# EAGLE design x8-oDisplayV1.3 (EAGLE 6.5.0)
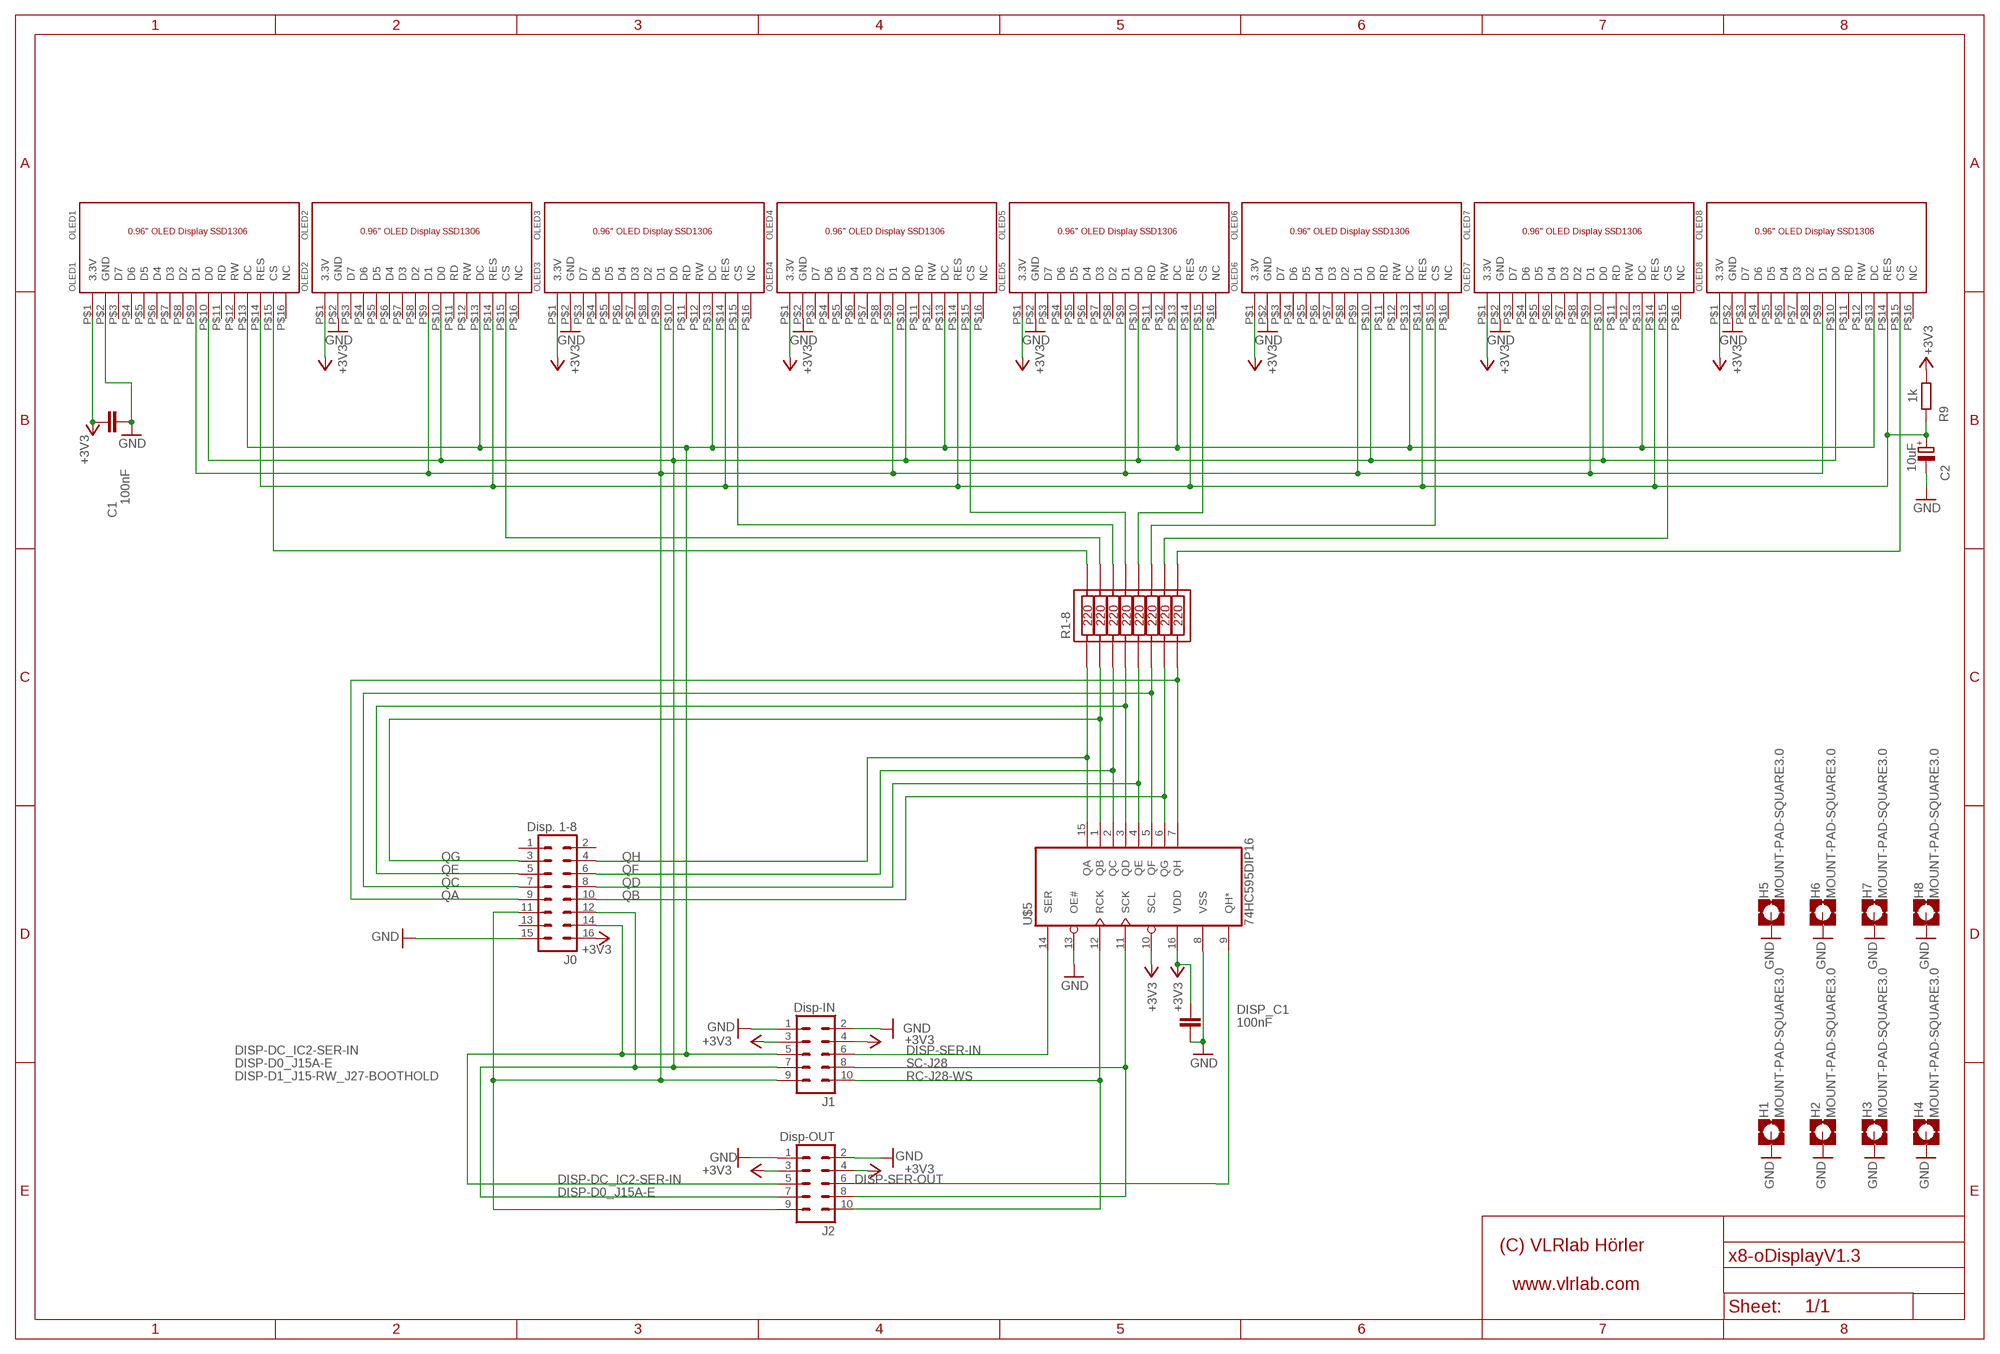
[diagram p0: schematic, sheet 1]

## Parts
C1  100nF  C5/3  [C5B3]
C2  10uF  CPOL-EUE2.5-6  [E2,5-6]
DISP_C1  100nF  C5/3  [C5B3]
H1  MOUNT-PAD-SQUARE3.0  [3,0-PAD-SQUARE]
H2  MOUNT-PAD-SQUARE3.0  [3,0-PAD-SQUARE]
H3  MOUNT-PAD-SQUARE3.0  [3,0-PAD-SQUARE]
H4  MOUNT-PAD-SQUARE3.0  [3,0-PAD-SQUARE]
H5  MOUNT-PAD-SQUARE3.0  [3,0-PAD-SQUARE]
H6  MOUNT-PAD-SQUARE3.0  [3,0-PAD-SQUARE]
H7  MOUNT-PAD-SQUARE3.0  [3,0-PAD-SQUARE]
H8  MOUNT-PAD-SQUARE3.0  [3,0-PAD-SQUARE]
J0  Disp. 1-8  ML16  [ML16]
J1  Disp-IN  ML10  [ML10]
J2  Disp-OUT  ML10  [ML10]
OLED1  OLED1  0.96"OLED  [0.96"]
OLED2  OLED2  0.96"OLED  [0.96"]
OLED3  OLED3  0.96"OLED  [0.96"]
OLED4  OLED4  0.96"OLED  [0.96"]
OLED5  OLED5  0.96"OLED  [0.96"]
OLED6  OLED6  0.96"OLED  [0.96"]
OLED7  OLED7  0.96"OLED  [0.96"]
OLED8  OLED8  0.96"OLED  [0.96"]
R1-8  4116R  [DIL16]
R9  1k  R-EU_0204/7  [0204/7]
U$5  74HC595DIP16  [DIL16]

## Nets
+3V3 [VDD]: C1.1 DISP_C1.1 J0.16 J1.3 J1.4 J2.3 J2.4 OLED1.P$1(3.3V) OLED2.P$1(3.3V) OLED3.P$1(3.3V) OLED4.P$1(3.3V) OLED5.P$1(3.3V) OLED6.P$1(3.3V) OLED7.P$1(3.3V) OLED8.P$1(3.3V) R9.2 U$5.10(SCL) U$5.16(VDD)
DISP-D0_J15A-E: J0.12 J1.7 J2.7 OLED1.P$10(D0) OLED2.P$10(D0) OLED3.P$10(D0) OLED4.P$10(D0) OLED5.P$10(D0) OLED6.P$10(D0) OLED7.P$10(D0) OLED8.P$10(D0)
DISP-D1_J15-RW_J27-BOOTHOLD: J0.11 J1.9 J2.9 OLED1.P$9(D1) OLED2.P$9(D1) OLED3.P$9(D1) OLED4.P$9(D1) OLED5.P$9(D1) OLED6.P$9(D1) OLED7.P$9(D1) OLED8.P$9(D1)
DISP-DC_IC2-SER-IN: J0.14 J1.5 J2.5 OLED1.P$13(DC) OLED2.P$13(DC) OLED3.P$13(DC) OLED4.P$13(DC) OLED5.P$13(DC) OLED6.P$13(DC) OLED7.P$13(DC) OLED8.P$13(DC)
DISP-SER-IN: J1.6 U$5.14(SER)
DISP-SER-OUT: J2.6 U$5.9(QH*)
GND: C1.2 C2.- DISP_C1.2 H1.B3,0(MOUNT) H2.B3,0(MOUNT) H3.B3,0(MOUNT) H4.B3,0(MOUNT) H5.B3,0(MOUNT) H6.B3,0(MOUNT) H7.B3,0(MOUNT) H8.B3,0(MOUNT) J0.15 J1.1 J1.2 J2.1 J2.2 OLED1.P$2(GND) OLED2.P$2(GND) OLED3.P$2(GND) OLED4.P$2(GND) OLED5.P$2(GND) OLED6.P$2(GND) OLED7.P$2(GND) OLED8.P$2(GND) U$5.8(VSS) U$5.13(OE#)
QA: J0.9 R1-8.16 U$5.7(QH)
QAA: OLED8.P$15(CS) R1-8.8
QB: J0.10 R1-8.15 U$5.6(QG)
QBB: OLED7.P$15(CS) R1-8.7
QC: J0.7 R1-8.14 U$5.5(QF)
QCC: OLED6.P$15(CS) R1-8.6
QD: J0.8 R1-8.13 U$5.4(QE)
QDD: OLED5.P$15(CS) R1-8.5
QE: J0.5 R1-8.12 U$5.3(QD)
QEE: OLED4.P$15(CS) R1-8.4
QF: J0.6 R1-8.11 U$5.2(QC)
QFF: OLED3.P$15(CS) R1-8.3
QG: J0.3 R1-8.10 U$5.1(QB)
QGG: OLED2.P$15(CS) R1-8.2
QH: J0.4 R1-8.9 U$5.15(QA)
QHH: OLED1.P$15(CS) R1-8.1
RC-J28-WS: J1.10 J2.10 U$5.12(RCK)
RST: C2.+ OLED1.P$14(RES) OLED2.P$14(RES) OLED3.P$14(RES) OLED4.P$14(RES) OLED5.P$14(RES) OLED6.P$14(RES) OLED7.P$14(RES) OLED8.P$14(RES) R9.1
SC-J28: J1.8 J2.8 U$5.11(SCK)
Unconnected: J0.1 J0.2 J0.13 OLED1.P$3(D7) OLED1.P$4(D6) OLED1.P$5(D5) OLED1.P$6(D4) OLED1.P$7(D3) OLED1.P$8(D2) OLED1.P$11(RD) OLED1.P$12(RW) OLED1.P$16(NC) OLED2.P$3(D7) OLED2.P$4(D6) OLED2.P$5(D5) OLED2.P$6(D4) OLED2.P$7(D3) OLED2.P$8(D2) OLED2.P$11(RD) OLED2.P$12(RW) OLED2.P$16(NC) OLED3.P$3(D7) OLED3.P$4(D6) OLED3.P$5(D5) OLED3.P$6(D4) OLED3.P$7(D3) OLED3.P$8(D2) OLED3.P$11(RD) OLED3.P$12(RW) OLED3.P$16(NC) OLED4.P$3(D7) OLED4.P$4(D6) OLED4.P$5(D5) OLED4.P$6(D4) OLED4.P$7(D3) OLED4.P$8(D2) OLED4.P$11(RD) OLED4.P$12(RW) OLED4.P$16(NC) OLED5.P$3(D7) OLED5.P$4(D6) OLED5.P$5(D5) OLED5.P$6(D4) OLED5.P$7(D3) OLED5.P$8(D2) OLED5.P$11(RD) OLED5.P$12(RW) OLED5.P$16(NC) OLED6.P$3(D7) OLED6.P$4(D6) OLED6.P$5(D5) OLED6.P$6(D4) OLED6.P$7(D3) OLED6.P$8(D2) OLED6.P$11(RD) OLED6.P$12(RW) OLED6.P$16(NC) OLED7.P$3(D7) OLED7.P$4(D6) OLED7.P$5(D5) OLED7.P$6(D4) OLED7.P$7(D3) OLED7.P$8(D2) OLED7.P$11(RD) OLED7.P$12(RW) OLED7.P$16(NC) OLED8.P$3(D7) OLED8.P$4(D6) OLED8.P$5(D5) OLED8.P$6(D4) OLED8.P$7(D3) OLED8.P$8(D2) OLED8.P$11(RD) OLED8.P$12(RW) OLED8.P$16(NC)

## Library data of the parts
C1 DISP_C1 = capacitor-wima:C: CAPACITOR naming: grid - package width
C2 = rcl:CPOL-EU: POLARIZED CAPACITOR, European symbol
H1-H8 = holes:MOUNT-PAD-SQUARE: MOUNTING PAD, square
J0 = con-ml:ML16: HARTING; OC_FARNELL: unknown; OC_NEWARK: unknown
J1 J2 = con-harting-ml:ML10: HARTING; OC_FARNELL: unknown; OC_NEWARK: unknown
OLED1-OLED8 = 0.96" 128x64 OLED:0.96"OLED
R1-8 = Bourns Resistor Array:4116R
R9 = resistor:R-EU_: RESISTOR, European symbol
U$5 = 595-541-165-uln2803:74HC595

## Net classes
0 default: width 0.254 mm, drill 0.33 mm, clearance 0.203 mm
1 VDD: width 0.813 mm, drill 0.33 mm, clearance 0.203 mm to class 0, clearance 0.203 mm

## Board
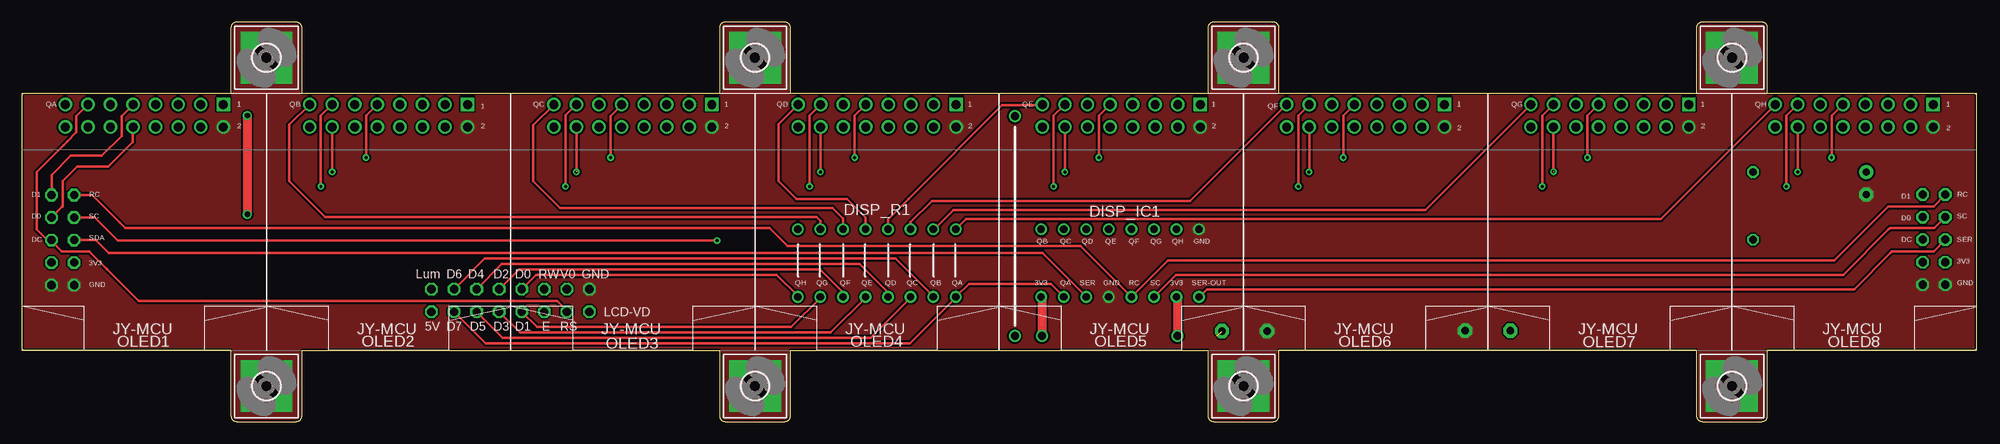
[diagram p1: board, top side]
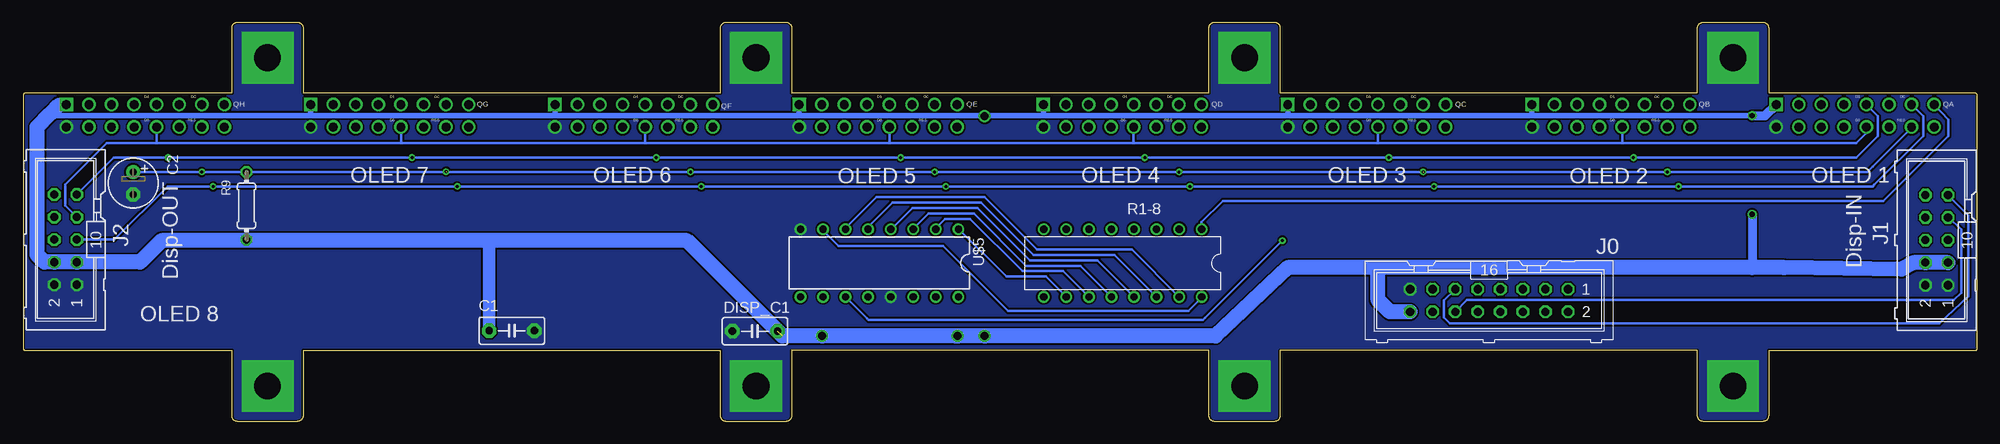
[diagram p2: board, bottom side, seen from below]

Size 220 x 45 mm. Coordinates in mm from the lower left corner, seen from the top.
Outline: 31.5,8 78.5,8 78.5,0.63 arc90 79.14,0 85.86,0 arc90 86.5,0.63 86.5,8 133.5,8 133.5,0.63 arc90 134.13,0 140.87,0 arc90 141.5,0.63 141.5,8 188.5,8 188.5,0.63 arc90 189.13,0 195.87,0 arc90 196.5,0.63 196.5,8 219.75,8 arc90 220,8.25 220,36.75 arc90 219.75,37 196.5,37 196.5,44.37 arc90 195.87,45 189.13,45 arc90 188.5,44.37 188.5,37 141.5,37 141.5,44.37 arc90 140.87,45 134.13,45 arc90 133.5,44.37 133.5,37 86.5,37 86.5,44.37 arc90 85.86,45 79.14,45 arc90 78.5,44.37 78.5,37 31.5,37 31.5,44.37 arc90 30.86,45 24.14,45 arc90 23.5,44.37 23.5,37 0.25,37 arc90 0,36.75 0,8.25 arc90 0.25,8 23.5,8 23.5,0.63 arc90 24.14,0 30.86,0 arc90 31.5,0.63 31.5,8
Copper layers (1*16): Top 0.035mm / dielectric 1.5mm / Bottom 0.035mm
Design rules "makePCB *": minimum track width 10mil, minimum drill 13mil, track to track 8mil, track to pad 8mil, pad to pad 8mil, via to via 8mil, smd to smd 8mil, copper to edge 8mil, drill to drill 8mil, minimum pad ring 10mil, minimum via ring 8mil, stop-mask expansion 4mil, vias tented up to drill 0mil, thermal gap 0mil

### Footprints (pad centres in the part's own frame; a part is rotated, then mirrored left to right if it is on the bottom)
C5B3 = drill 0.813 pad 1.6 octagon: 1 -2.54,0; 2 2.54,0
E2,5-6 = drill 0.813 pad 1.6: + -1.27,0 | drill 0.813 pad 1.6 octagon: - 1.27,0
3,0-PAD-SQUARE = drill 3 pad 5.842 square: B3,0 0,0
ML16 = drill 0.914 octagon: 1 -8.89,-1.27; 2 -8.89,1.27; 3 -6.35,-1.27; 4 -6.35,1.27; 5 -3.81,-1.27; 6 -3.81,1.27; 7 -1.27,-1.27; 8 -1.27,1.27; 9 1.27,-1.27; 10 1.27,1.27; 11 3.81,-1.27; 12 3.81,1.27; 13 6.35,-1.27; 14 6.35,1.27; 15 8.89,-1.27; 16 8.89,1.27
ML10 = drill 0.914 octagon: 1 -5.08,-1.27; 2 -5.08,1.27; 3 -2.54,-1.27; 4 -2.54,1.27; 5 0,-1.27; 6 0,1.27; 7 2.54,-1.27; 8 2.54,1.27; 9 5.08,-1.27; 10 5.08,1.27
0.96" = drill 1 square: P$1 22.64,27.73 | drill 1: P$2 22.64,25.19; P$3 20.1,27.73; P$4 20.1,25.19; P$5 17.56,27.73; P$6 17.56,25.19; P$7 15.02,27.73; P$8 15.02,25.19; P$9 12.48,27.73; P$10 12.48,25.19; P$11 9.94,27.73; P$12 9.94,25.19; P$13 7.4,27.73; P$14 7.4,25.19; P$15 4.86,27.73; P$16 4.86,25.19
DIL16 = drill 0.813: 1 -8.89,-3.81; 2 -6.35,-3.81; 3 -3.81,-3.81; 4 -1.27,-3.81; 5 1.27,-3.81; 6 3.81,-3.81; 7 6.35,-3.81; 8 8.89,-3.81; 9 8.89,3.81; 10 6.35,3.81; 11 3.81,3.81; 12 1.27,3.81; 13 -1.27,3.81; 14 -3.81,3.81; 15 -6.35,3.81; 16 -8.89,3.81
0204/7 = drill 0.813 octagon: 1 -3.81,0; 2 3.81,0

### Placement (x,y rotation side)
C1  165,10.24 0 bottom
C2  207.62,26.85 270 bottom
DISP_C1  137.62,10.18 180 bottom
H1  27.5,4 0 top
H2  82.5,4 0 top
H3  137.5,4 0 top
H4  192.5,4 0 top
H5  27.5,41 0 top
H6  82.5,41 0 top
H7  137.5,41 0 top
H8  192.5,41 0 top
J0  54.97,13.64 180 bottom
J1  4.57,20.45 90 bottom
J2  215.24,20.5 90 bottom
OLED1  0,8 0 top
OLED2  27.5,8 0 top
OLED3  55,8 0 top
OLED4  82.5,8 0 top
OLED5  110,8 0 top
OLED6  137.5,8 0 top
OLED7  165,8 0 top
OLED8  192.5,8 0 top
R1-8  96.22,17.86 180 bottom
R9  194.87,24.31 270 bottom
U$1  [X8ODISPLAY]  49.58,21.61 0 bottom
U$2  [VLRLAB]  81.08,22.02 0 bottom
U$4  [(C)T.KLOSE]  150.16,24.66 180 bottom
U$5  123.6,17.86 180 bottom

### Tracks (layer width: path | path; a pad name or v marks a point on that pad's centre or on a via)
+3V3  (via drill 0.6, 0.9)  (1 unrouted)
  Top 1.016: v25.35,34.47 v25.35,23.34 | U$5.16 114.81,14.04 v114.81,9.63 | U$5.10 130.05,13.95 v130.05,9.63
  Bottom 0.305: 167.84,20.39 179.93,20.39 R9.2 | v111.76,34.42 111.4,34.42 111.35,34.47
  Bottom 0.61: v25.35,34.47 50.19,34.47 | 50.19,34.47 77.78,34.47 | 77.78,34.47 105.26,34.47 | 105.26,34.47 111.35,34.47 132.64,34.47 | 132.64,34.47 160.17,34.47 | 160.17,34.47 187.71,34.47 | 187.71,34.47 216.36,34.47 216.46,34.47 216.81,34.82 | OLED7.P$1 187.64,34.53 187.71,34.47 | OLED6.P$1 160.14,34.5 160.17,34.47 | OLED5.P$1 132.64,34.47 | OLED4.P$1 105.14,34.58 105.26,34.47 | OLED3.P$1 77.64,34.6 77.78,34.47 | OLED2.P$1 50.14,34.52 50.19,34.47 | 215.24,35.64 215.19,35.64 216,35.64 | 25.35,16.99 21.74,17.35
  Bottom 0.813: 215.19,35.64 OLED8.P$1
  Bottom 1.016: v25.35,23.34 25.35,16.99 | v25.35,34.47 23.9,34.47 OLED1.P$1
  Bottom 1.422: C1.1 167.54,20.09 167.84,20.39
  Bottom 1.676: J1.3 J1.4 7.16,17.91 8.53,17.14 21.74,17.35 67.46,17.35 | 67.46,17.35 77.62,17.35 85.75,9.63 v111.76,9.63 v114.81,9.63 | v114.81,9.63 115.01,9.63 | 115.01,9.63 v130.05,9.63 134.52,9.63 145.29,20.39 167.84,20.39 204.42,20.39 206.86,17.96 J2.3 J2.4 217.63,17.96 218.44,18.77 218.44,33.2 217.02,34.62 216.81,34.82 216,35.64 | v114.81,9.63 115.01,9.63 | J0.16 66.14,12.37 67.46,13.69 67.46,17.35
DISP-D0_J15A-E
  Top 0.305: J1.7 4.47,24.15 4.57,24.26 4.57,27.1 6.2,28.73 9.7,28.73 12.45,31.47 12.45,33.16 OLED1.P$10
  Bottom 0.305: OLED1.P$10 12.48,32.5 13.61,31.37 40.03,31.37 | 40.03,31.37 67.46,31.37 | 67.46,31.37 95.1,31.37 | 95.1,31.37 122.53,31.37 | 122.53,31.37 149.96,31.37 | 149.96,31.37 150.16,31.37 177.6,31.37 | 177.6,31.37 177.8,31.37 204.99,31.37 | 204.99,31.37 OLED8.P$10 | OLED2.P$10 39.98,31.42 40.03,31.37 | OLED3.P$10 67.48,31.39 67.46,31.37 | OLED4.P$10 94.98,31.49 95.1,31.37 | OLED5.P$10 122.48,31.42 122.53,31.37 | OLED7.P$10 177.48,31.48 177.6,31.37 | OLED6.P$10 149.98,31.39 149.96,31.37 | 204.99,31.37 210.62,31.37 215.29,26.69 215.29,24.36 J2.7 | J1.7 3.2,22.99 1.83,21.61 1.83,14.5 2.64,13.69 49.84,13.69 57.45,13.69 J0.12
DISP-D1_J15-RW_J27-BOOTHOLD  (via drill 0.33)
  Top 0.254: OLED5.P$9 | OLED6.P$9 149.98,35.7 | OLED7.P$9
  Top 0.305: OLED2.P$9 38.71,34.47 38.71,29.84 v38.71,29.74 | OLED3.P$9 67.48,35.65 66.24,34.42 v66.24,29.74 | OLED4.P$9 93.73,34.47 v93.73,29.74 | OLED5.P$9 121.21,34.47 v121.21,29.74 | 149.98,35.7 148.74,34.47 v148.74,29.74 | OLED7.P$9 176.22,34.47 v176.22,29.74 | J1.9 3.3,27.76 5.49,29.95 8.94,29.95 11.18,32.18 11.18,34.43 OLED1.P$9 | OLED8.P$9 203.71,34.47 v203.71,29.74
  Bottom 0.305: OLED1.P$9 11.18,34.42 11.18,32.18 13.61,29.74 v38.71,29.74 | v38.71,29.74 39.01,29.74 | 39.01,29.74 v66.24,29.74 v93.73,29.74 v121.21,29.74 v148.74,29.74 v176.22,29.74 v203.71,29.74 203.81,29.74 209.8,29.74 J2.9 | v38.71,29.74 39.01,29.74 | J1.9 1.02,23.24 1.02,14.1 4.27,11.05 49.73,11.05 59.38,11.05 60.05,11.71 60.05,13.64 J0.11
DISP-DC_IC2-SER-IN  (via drill 0.33)
  Top 0.254: OLED5.P$13 | OLED6.P$13 144.9,35.7 | OLED7.P$13 | OLED8.P$13
  Top 0.305: OLED2.P$13 33.63,34.47 v33.63,26.49 | OLED3.P$13 62.38,35.73 61.16,34.52 v61.16,26.49 | OLED4.P$13 88.65,34.47 v88.65,26.49 | OLED5.P$13 116.13,34.47 v116.13,26.49 | 144.9,35.7 143.66,34.47 v143.66,26.49 | OLED7.P$13 171.15,34.47 v171.15,26.49 | OLED8.P$13 198.63,34.47 v198.63,26.49 | OLED1.P$13 6.1,34.43 6.1,32.59 5.08,31.57 4.67,31.16 1.63,28.12 1.63,21.61 2.79,20.45 J1.5 3.3,20.34 4.47,19.18 7.52,19.18 9.45,17.25 | 9.45,17.25 9.55,17.14 | J0.14 61.32,12.52 60.25,13.59 13.11,13.59 9.45,17.25
  Bottom 0.305: OLED1.P$13 6.1,34.42 6.1,32.18 11.58,26.69 11.79,26.49 v33.63,26.49 v61.16,26.49 v88.65,26.49 v116.13,26.49 v143.66,26.49 v171.15,26.49 v198.63,26.49 199.75,26.49 203.76,26.49 209.75,20.5 J2.5
DISP-SER-IN
  Top 0.305: J1.6 8.28,20.45 9.75,18.97 86,18.97 114.87,18.97 U$5.14
DISP-SER-OUT
  Top 0.305: J2.6 215.19,19.18 210.51,19.18 210.31,18.97 206.25,14.91 133.71,14.91 133.36,14.91 U$5.9
GND
  pour Top: 0,37 23.5,37 23.5,45 31.5,45 31.5,37 78.5,37 78.5,45 86.5,45 86.5,37 133.5,37 133.5,45 141.5,45 141.5,37 188.5,37 188.5,45 196.5,45 196.5,37 220,37 220,8 196.5,8 196.5,0 188.5,0 188.5,8 141.5,8 141.5,0 133.5,0 133.5,7.5 133.5,8 86.5,8 86.5,0 78.5,0 78.5,8 31.5,8 31.5,0 23.5,0 23.5,8 0,8
  pour Bottom: 0,37 23.5,37 23.5,45 31.5,45 31.5,37 78.5,37 78.5,45 86.5,45 86.5,37 133.5,37 133.5,45 141.5,45 141.5,37 188.5,37 188.5,45 196.5,45 196.5,37 220,37 220,8 196.5,8 196.5,0 188.5,0 188.5,8 141.5,8 141.5,0 133.5,0 133.5,7.5 133.5,8 86.5,8 86.5,0 78.5,0 78.5,8 31.5,8 31.5,0 23.5,0 23.5,8 0,8
QA
  Top 0.305: J0.9 57.86,16.53 84.94,16.53 87.33,14.15 R1-8.16
  Bottom 0.305: R1-8.16 87.33,13.94 88.8,12.47 106.27,12.47 109.12,12.47 116.43,19.79 128.22,19.79 129.96,21.52 U$5.7
QAA
  Top 0.305: R1-8.8 106.27,22.83 184.46,22.83 OLED8.P$15
QB
  Top 0.305: J0.10 57.96,10.64 86.56,10.64 89.86,13.94 R1-8.15
  Bottom 0.305: R1-8.15 95.2,19.38 105.87,19.38 111.76,25.27 123.95,25.27 127.42,21.81 U$5.6
QBB
  Top 0.305: R1-8.7 102.67,21.66 104.85,23.85 157.98,23.85 OLED7.P$15
QC
  Top 0.305: J0.7 55.93,17.14 89.81,17.14 92.41,14.55 R1-8.14
  Bottom 0.305: R1-8.14 97.13,18.77 106.27,18.77 112.17,24.66 122.12,24.66 124.88,21.91 U$5.5
QCC
  Top 0.305: R1-8.6 100.03,22.48 102.41,24.87 131.5,24.87 OLED6.P$15
QD
  Top 0.305: J0.8 56.03,10.03 91.03,10.03 94.94,13.94 R1-8.13
  Bottom 0.305: R1-8.13 99.06,18.16 106.68,18.16 112.57,24.05 119.89,24.05 122.28,21.66 U$5.4
QDD
  Top 0.305: R1-8.5 97.48,22.78 99.77,25.07 110.34,35.64 114.77,35.64 OLED5.P$15
QE
  Top 0.305: J0.5 54,17.75 94.28,17.75 97.48,14.55 R1-8.12
  Bottom 0.305: R1-8.12 100.99,17.55 107.09,17.55 112.98,23.44 118.06,23.44 119.8,21.71 U$5.3
QEE
  Top 0.305: R1-8.4 94.94,22.99 92.86,25.07 87.17,25.07 85.14,27.1 85.14,33.51 OLED4.P$15
QF
  Top 0.305: J0.6 54.1,9.42 95.5,9.42 100.03,13.94 R1-8.11
  Bottom 0.305: R1-8.11 102.92,16.94 107.49,16.94 113.39,22.83 116.23,22.83 117.25,21.81 U$5.2
QFF
  Top 0.305: R1-8.3 92.41,22.88 91.24,24.05 60.55,24.05 57.51,27.1 57.51,33.38 OLED3.P$15
QG
  Top 0.305: J0.3 52.07,18.36 98.35,18.36 102.56,14.15 R1-8.10
  Bottom 0.305: R1-8.10 104.85,16.33 109.32,16.33 114.66,21.66 U$5.1
QGG
  Top 0.305: R1-8.2 89.86,22.58 89.41,23.04 34.14,23.04 30.07,27.1 30.07,33.44 OLED2.P$15
QH
  Top 0.305: U$5.15 117.25,14.09 115.82,15.52 106.58,15.52 R1-8.9 105.11,13.94 99.97,8.81 52.17,8.81 J0.4
QHH
  Bottom 0.305: R1-8.1 87.33,22.48 84.94,24.87 10.57,24.87 3.25,32.18 3.25,33.81 3.25,34.01 4.76,35.64 OLED1.P$15
RC-J28-WS
  Top 0.305: J1.10 7.87,25.53 10.97,22.43 11.58,21.82 84.12,21.82 86.16,19.79 119.13,19.79 U$5.12 128.99,18.16 129.24,18.16 204.01,18.16 210.11,24.26 215.19,24.26 J2.10
RST  (via drill 0.33)  (2 unrouted)
  Top 0.254: v117.4,28.12 | 144.9,28.14 v144.88,28.12 | 172.4,28.13 172.41,27.91
  Top 0.305: OLED2.P$14 v34.9,28.12 | v34.9,28.12 | OLED3.P$14 62.4,28.15 62.43,28.12 | OLED4.P$14 89.9,28.15 v89.86,28.12 | OLED5.P$14 v117.4,28.12 | OLED6.P$14 144.9,28.14 | OLED7.P$14 v172.4,28.15 | v199.9,28.12 OLED8.P$14
  Bottom 0.305: OLED1.P$14 7.4,33.11 11.79,28.73 12.39,28.12 34.75,28.12 | 34.75,28.12 v34.9,28.12 | v34.9,28.12 v62.38,28.12 v89.86,28.12 v117.4,28.12 v144.88,28.12 172.36,28.12 | 172.36,28.12 172.62,28.12 | 172.62,28.12 R9.1 | R9.1 v199.9,28.12 | v199.9,28.12 199.95,28.12 | v34.9,28.12 34.75,28.12 | C2.+ v199.9,28.12 | 172.62,28.12 R9.1 | v172.4,28.15 172.36,28.12 | OLED8.P$14
SC-J28  (via drill 0.33)
  Top 0.305: J1.8 8.18,22.99 10.77,20.39 v78.23,20.39 | J2.8 215.29,21.82 210.31,21.82 210.11,21.61 205.03,16.53 130.05,16.53 129.9,16.53 U$5.11
  Bottom 0.305: v78.23,20.39 86.97,11.66 87.17,11.45 124.82,11.45 125.02,11.65 U$5.11

### Text on the board
bPlace: OLED 1 | OLED 2 | OLED 3 | OLED 4 | OLED 5 | OLED 6 | OLED 7 | OLED 8
tNames: QA | 1 | QB | 1 | QC | 1 | QD | 1 | QE | 1 | QF | 1 | QG | 1 | QH | 1 | 2 | 2 | 2 | 2 | 2 | 2 | 2 | 2 | D1 | RC | D1 | RC | D0 | SC | DISP_R1 | DISP_IC1 | D0 | SC | DC | SDA | QB | QC | QD | QE | QF | QG | QH | GND | DC | SER | 3V3 | 3V3 | Lum | D6 | D4 | D2 | D0 | RW | V0 | GND | GND | QH | QG | QF | QE | QD | QC | QB | QA | 3V3 | QA | SER | GND | RC | SC | 3V3 | SER-OUT | GND | LCD-VD | 5V | D7 | D5 | D3 | D1 | E | RS
bNames: DC | D1 | DC | D1 | DC | D1 | DC | D1 | DC | D1 | DC | D1 | DC | D1 | DC | D1 | QA | QB | QC | QD | QE | QF | QG | QH | RES | D0 | RES | D0 | RES | D0 | RES | D0 | RES | D0 | RES | D0 | RES | D0 | RES | D0